# EAGLE design mwscoretransponder2013 (EAGLE 6.1)
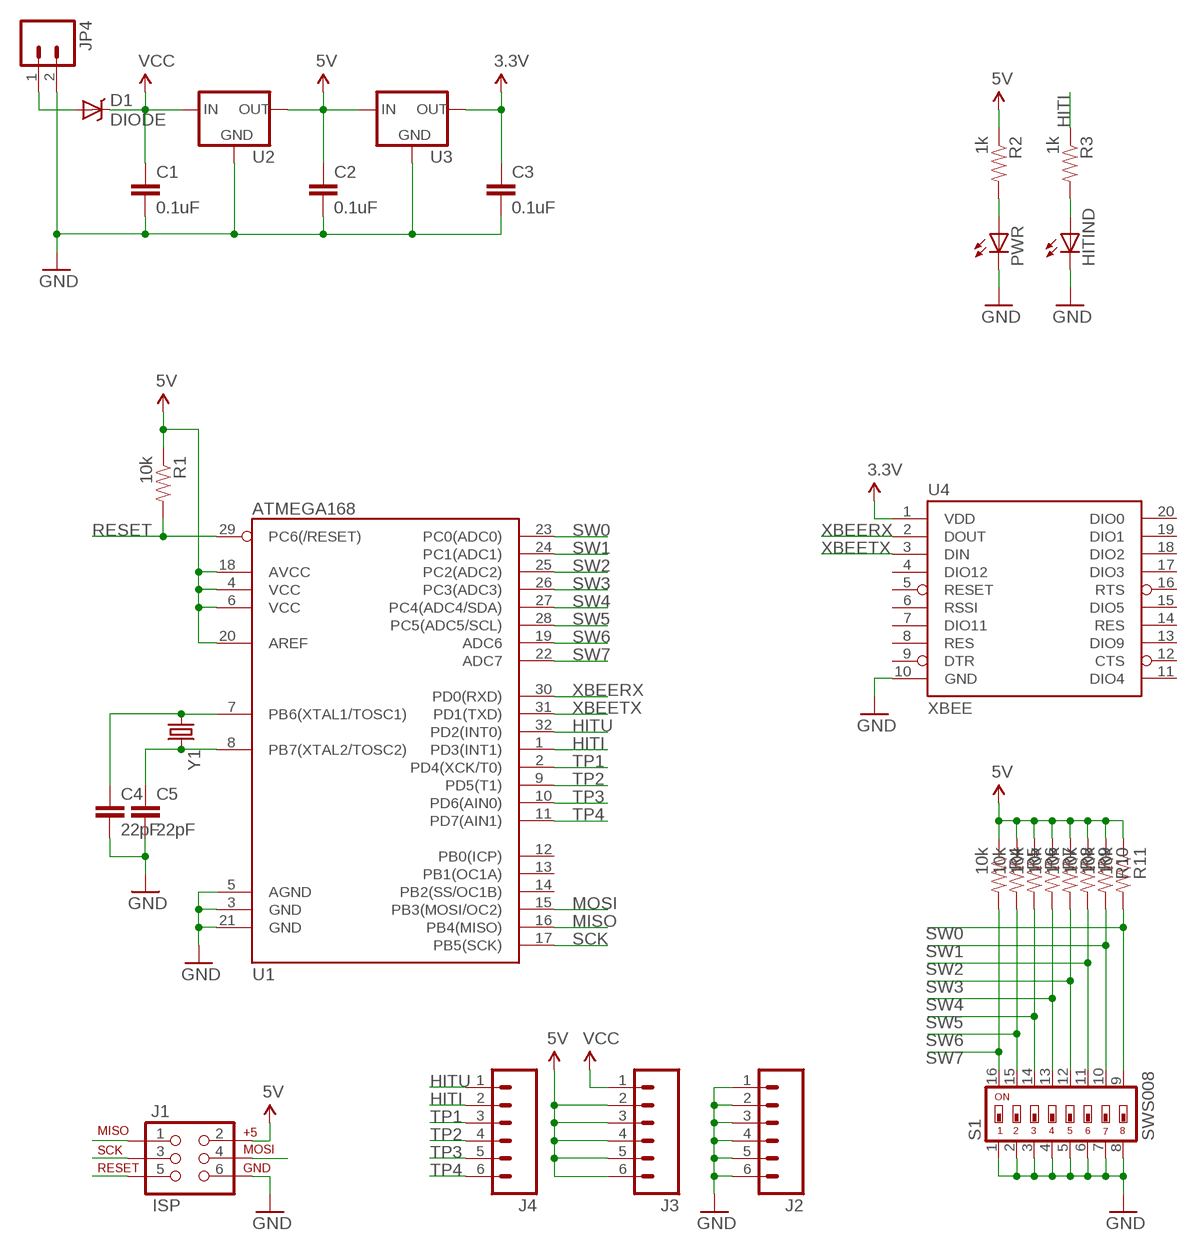
[diagram p0: schematic, sheet 1]

## Parts
C1  0.1uF  CAP0603-CAP  [0603-CAP]
C2  0.1uF  CAP0603-CAP  [0603-CAP]
C3  0.1uF  CAP0603-CAP  [0603-CAP]
C4  22pF  CAP0603-CAP  [0603-CAP]
C5  22pF  CAP0603-CAP  [0603-CAP]
D1  DIODE  DIODE-SCHOTTKY_  [SMA-DIODE]
HITIND  LED0603  [LED-0603]
J1  ISP  AVR_SPI_PRG_6PTH  [2X3]
J2  M06SIP  [1X06]
J3  M06SIP  [1X06]
J4  M06SIP  [1X06]
JP4  M023.5MM_LOCK  [SCREWTERMINAL-3.5MM-2_LOCK]
PWR  LED0603  [LED-0603]
R1  10k  RESISTOR0603-RES  [0603-RES]
R2  1k  RESISTOR0603-RES  [0603-RES]
R3  1k  RESISTOR0603-RES  [0603-RES]
R4  10k  RESISTOR0603-RES  [0603-RES]
R5  10k  RESISTOR0603-RES  [0603-RES]
R6  10k  RESISTOR0603-RES  [0603-RES]
R7  10k  RESISTOR0603-RES  [0603-RES]
R8  10k  RESISTOR0603-RES  [0603-RES]
R9  10k  RESISTOR0603-RES  [0603-RES]
R10  10k  RESISTOR0603-RES  [0603-RES]
R11  10k  RESISTOR0603-RES  [0603-RES]
S1  SWS008  [SMS-008]
U1  ATMEGA168  [TQFP32-08]
U2  V_REG_MIC2920  [SOT223]
U3  V_REG_MIC2920  [SOT223]
U4  XBEE  XBEE-1B3  [XBEE-SMD]
Y1  CRYSTAL5X3  [CRYSTAL-SMD-5X3]

## Nets
3.3V: C3.1 U3.3(OUT) U4.1(VDD)
5V: C2.1 J1.2 J3.2 J3.3 J3.4 J3.5 J3.6 R1.1 R2.1 R4.1 R5.1 R6.1 R7.1 R8.1 R9.1 R10.1 R11.1 U1.4(VCC) U1.6(VCC) U1.18(AVCC) U1.20(AREF) U2.3(OUT) U3.1(IN)
GND: C1.2 C2.2 C3.2 C4.2 C5.2 HITIND.C J1.6 J2.1 J2.2 J2.3 J2.4 J2.5 J2.6 JP4.2 PWR.C S1.1 S1.2 S1.3 S1.4 S1.5 S1.6 S1.7 S1.8 U1.3(GND) U1.5(AGND) U1.21(GND) U2.2(GND) U3.2(GND) U4.10(GND)
HITI: J4.2 R3.1 U1.1(PD3(INT1))
HITU: J4.1 U1.32(PD2(INT0))
MISO: J1.1 U1.16(PB4(MISO))
MOSI: J1.4 U1.15(PB3(MOSI/OC2))
N$1: PWR.A R2.2
N$2: HITIND.A R3.2
N$3: C4.1 U1.7(PB6(XTAL1/TOSC1)) Y1.1
N$4: D1.A JP4.1
N$6: C5.1 U1.8(PB7(XTAL2/TOSC2)) Y1.3
RESET: J1.5 R1.2 U1.29(PC6(/RESET))
SCK: J1.3 U1.17(PB5(SCK))
SW0: R11.2 S1.9 U1.23(PC0(ADC0))
SW1: R10.2 S1.10 U1.24(PC1(ADC1))
SW2: R9.2 S1.11 U1.25(PC2(ADC2))
SW3: R8.2 S1.12 U1.26(PC3(ADC3))
SW4: R7.2 S1.13 U1.27(PC4(ADC4/SDA))
SW5: R6.2 S1.14 U1.28(PC5(ADC5/SCL))
SW6: R5.2 S1.15 U1.19(ADC6)
SW7: R4.2 S1.16 U1.22(ADC7)
TP1: J4.3 U1.2(PD4(XCK/T0))
TP2: J4.4 U1.9(PD5(T1))
TP3: J4.5 U1.10(PD6(AIN0))
TP4: J4.6 U1.11(PD7(AIN1))
VCC: C1.1 D1.C J3.1 U2.1(IN)
XBEERX: U1.30(PD0(RXD)) U4.2(DOUT)
XBEETX: U1.31(PD1(TXD)) U4.3(DIN)
Unconnected: U1.12(PB0(ICP)) U1.13(PB1(OC1A)) U1.14(PB2(SS/OC1B)) U4.4(DIO12) U4.5(RESET) U4.6(RSSI) U4.7(DIO11) U4.8(RES) U4.9(DTR) U4.11(DIO4) U4.12(CTS) U4.13(DIO9) U4.14(RES) U4.15(DIO5) U4.16(RTS) U4.17(DIO3) U4.18(DIO2) U4.19(DIO1) U4.20(DIO0)

## Library data of the parts
C1-C5 = SparkFun:CAP: Capacitor Standard 0603 ceramic capacitor, and 0.1" leaded capacitor.
D1 = SparkFun:DIODE-SCHOTTKY
HITIND PWR = SparkFun:LED: LEDs Standard schematic elements and footprints for 5mm, 3mm, 1206, and 0603 sized LEDs. 5mm - Spark Fun Electronics SKU : COM-00529 (and others)
J1 = SparkFun:AVR_SPI_PRG_6: AVR ISP 6 Pin This is the reduced ISP connector for AVR programming. Common on Arduino. This footprint will take up less PCB space and can be used with a 10-pin to 6-pin adapter such as SKU: BOB-08508
J2-J4 = SparkFun:M06: Header 6 Standard 6-pin 0.1" header. Use with straight break away headers (SKU : PRT-00116), right angle break away headers (PRT-00553), swiss pins (PRT-00743), machine pins (PRT-00117), and female headers (PRT-00115). Molex polarized connector foot print use with SKU : PRT-08094 with associated crimp pins and housings. NOTES ON THE VARIANTS LOCK and LOCK_LONGPADS... This footprint was designed to help hold the alignment of a through-hole component (i.e. 6-pin header) while soldering it into place. You may notice that each hole has been shifted either up or down by 0.005 of an inch from it's more standard position (which is a perfectly straight line). This slight alteration caused the pins (the squares in the middle) to touch the edges of the holes. Because they are alternating, it causes a "brace" to hold the component in place. 0.005 has proven to be the perfect amount of "off-center" position when using our standard breakaway headers. Although looks a little odd when you look at the bare footprint, once you have a header in there, the alteration is very hard to notice. Also, if you push a header all the way into place, it is covered up entirely on the bottom side. This idea of altering the position of holes to aid alignment will be further integrated into the Sparkfun Library for other footprints. It can help hold any component with 3 or more connection pins.
JP4 = SparkFun:M02: Header 2 Standard 2-pin 0.1" header. Use with straight break away headers (SKU : PRT-00116), right angle break away headers (PRT-00553), swiss pins (PRT-00743), machine pins (PRT-00117), and female headers (PRT-00115). Molex polarized connector foot print use with SKU : PRT-08233 with associated crimp pins and housings.
R1-R11 = SparkFun:RESISTOR: Resistor Basic schematic elements and footprints for 0603, 1206, and PTH resistors.
S1 = smd-special:SWS008: SMD Dip Switch 8 pol.
U1 = SparkFun:ATMEGA168
U2 U3 = SparkFun:V_REG_MIC2920: MIC2920A (http://www.micrel.com/_PDF/mic2920.pdf) - 400mA output LDO Regulator
U4 = SparkFun:XBEE-1
Y1 = SparkFun:CRYSTAL: Crystals Various standard crystals. Proven footprints. Spark Fun Electronics SKU : COM-00534

## Board
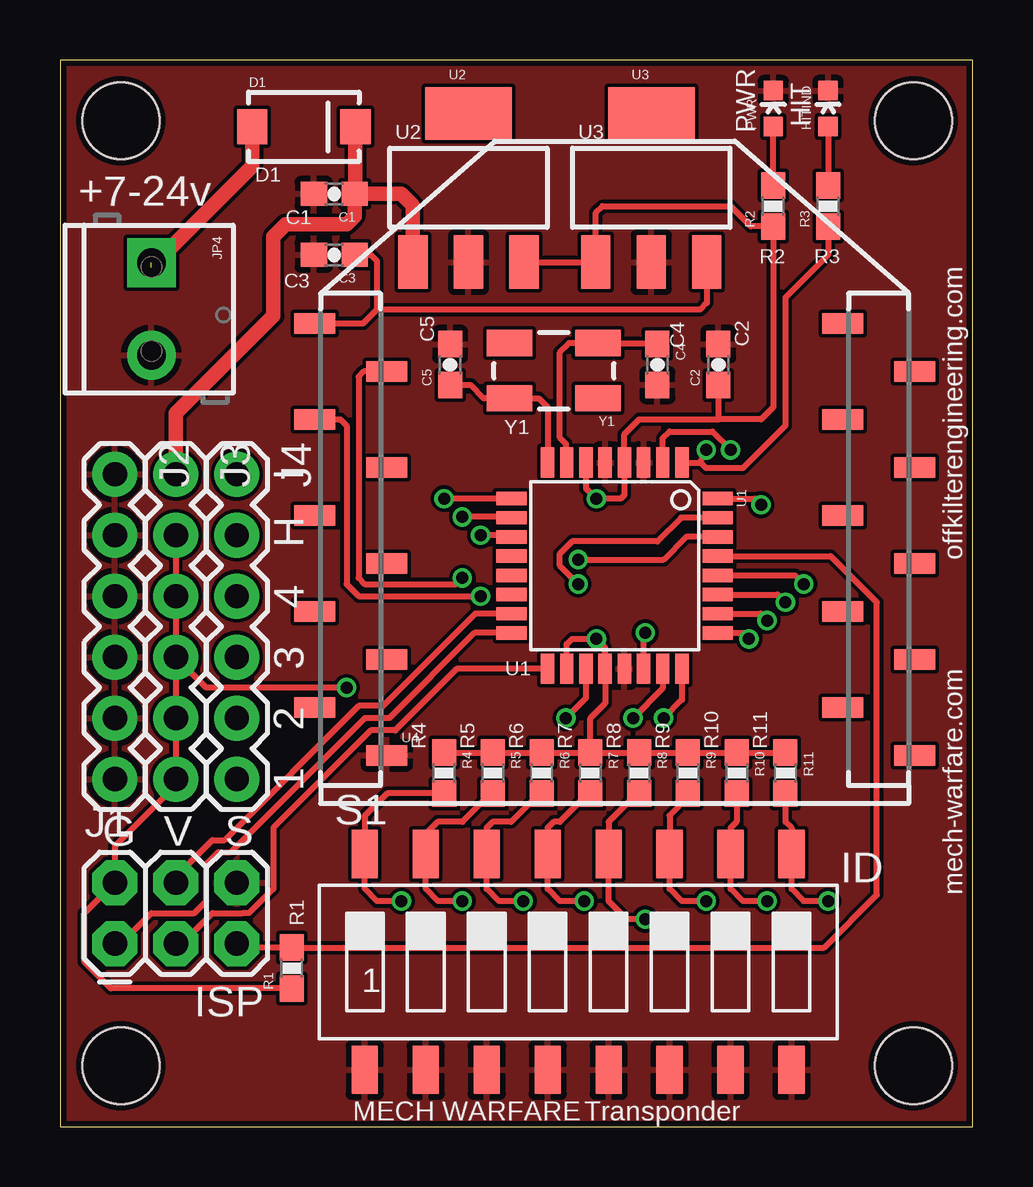
[diagram p1: board, top side]
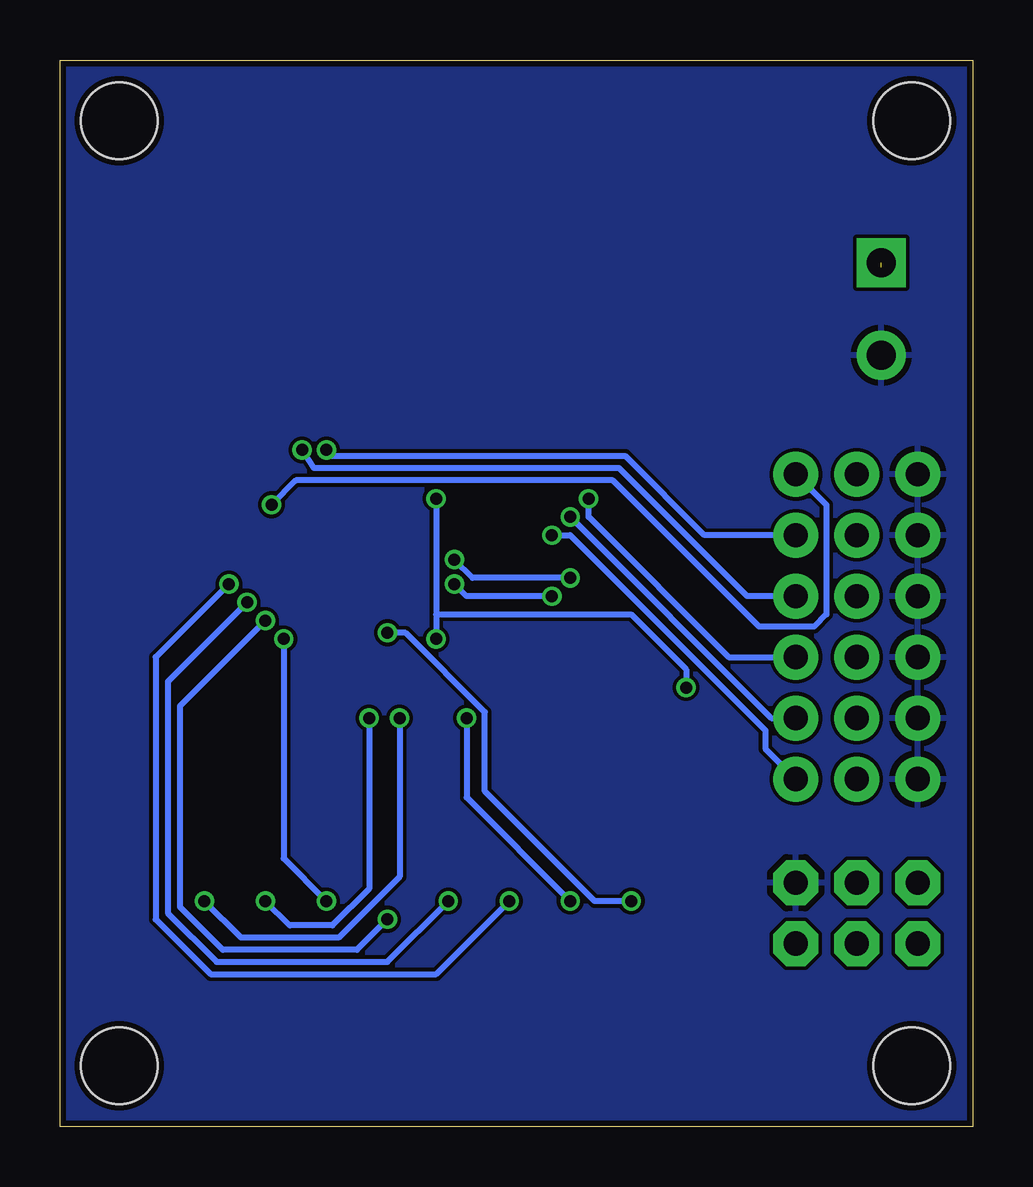
[diagram p2: board, bottom side, seen from below]

Size 38.02 x 44.44 mm. Coordinates in mm from the lower left corner, seen from the top.
Outline: 0,0 38.02,0 38.02,44.44 0,44.44 0,0
Copper layers (1*16): Top 0.035mm / dielectric 1.5mm / Bottom 0.035mm
Design rules: minimum track width 6mil, minimum drill 12mil, track to track 6mil, track to pad 6mil, pad to pad 6mil, via to via 6mil, smd to smd 0mil, copper to edge 10mil, drill to drill 10mil, minimum pad ring 10mil, minimum via ring 6mil, stop-mask expansion 2mil, vias tented up to drill 100mil, thermal gap 10mil
Holes 3.2 mm at 2.54,2.54 35.56,2.54 2.54,41.91 35.56,41.91

### Footprints (pad centres in the part's own frame; a part is rotated, then mirrored left to right if it is on the bottom)
0603-CAP = smd 1.1 x 1: 1 -0.85,0; 2 0.85,0
SMA-DIODE = smd 1.27 x 1.47: A -2.15,0; C 2.15,0
LED-0603 = smd 0.8 x 0.8: A 0,-0.75; C 0,0.75
2X3 = drill 1.016 pad 1.88 octagon: 1 0,0; 2 0,2.54; 3 2.54,0; 4 2.54,2.54; 5 5.08,0; 6 5.08,2.54
1X06 = drill 1.016 pad 1.88: 1 0,0; 2 2.54,0; 3 5.08,0; 4 7.62,0; 5 10.16,0; 6 12.7,0
SCREWTERMINAL-3.5MM-2_LOCK = drill 1.2 pad 2.032 square: 1 -0.178,0 | drill 1.2 pad 2.032: 2 3.678,0
0603-RES = smd 1.1 x 1: 1 -0.85,0; 2 0.85,0
SMS-008 = smd 1.092 x 2.007: 1 -8.89,-4.496; 2 -6.35,-4.496; 3 -3.81,-4.496; 4 -1.27,-4.496; 5 1.27,-4.496; 6 3.81,-4.496; 7 6.35,-4.496; 8 8.89,-4.496; 9 8.89,4.496; 10 6.35,4.496; 11 3.81,4.496; 12 1.27,4.496; 13 -1.27,4.496; 14 -3.81,4.496; 15 -6.35,4.496; 16 -8.89,4.496
TQFP32-08 = smd 1.27 x 0.559: 1 -4.293,2.8; 2 -4.293,2; 3 -4.293,1.2; 4 -4.293,0.4; 5 -4.293,-0.4; 6 -4.293,-1.2; 7 -4.293,-2; 8 -4.293,-2.8; 17 4.293,-2.8; 18 4.293,-2; 19 4.293,-1.2; 20 4.293,-0.4; 21 4.293,0.4; 22 4.293,1.2; 23 4.293,2; 24 4.293,2.8 | smd 0.559 x 1.27: 9 -2.8,-4.293; 10 -2,-4.293; 11 -1.2,-4.293; 12 -0.4,-4.293; 13 0.4,-4.293; 14 1.2,-4.293; 15 2,-4.293; 16 2.8,-4.293; 25 2.8,4.293; 26 2,4.293; 27 1.2,4.293; 28 0.4,4.293; 29 -0.4,4.293; 30 -1.2,4.293; 31 -2,4.293; 32 -2.8,4.293
SOT223 = smd 1.219 x 2.235: 1 -2.311,-3.099; 2 0,-3.099; 3 2.311,-3.099 | smd 3.6 x 2.2: 4 0,3.099
XBEE-SMD = smd 1.7 x 0.85: 1 -12.5,20; 2 -9.5,18; 3 -12.5,16; 4 -9.5,14; 5 -12.5,12; 6 -9.5,10; 7 -12.5,8; 8 -9.5,6; 9 -12.5,4; 10 -9.5,2; 11 12.5,2; 12 9.5,4; 13 12.5,6; 14 9.5,8; 15 12.5,10; 16 9.5,12; 17 12.5,14; 18 9.5,16; 19 12.5,18; 20 9.5,20
CRYSTAL-SMD-5X3 = smd 1.9 x 1.1: 1 -1.85,-1.15; 2 1.85,-1.15; 3 1.85,1.15; 4 -1.85,1.15

### Placement (x,y rotation side)
C1  11.43,38.86 180 top
C2  27.43,31.75 90 top
C3  11.43,36.32 180 top
C4  24.89,31.75 270 top
C5  16.26,31.75 90 top
D1  10.16,41.66 0 top
HITIND  32,42.42 0 top
J1  2.29,7.62 0 top
J2  2.29,27.18 270 top
J3  4.83,27.18 270 top
J4  7.37,27.18 270 top
JP4  3.81,35.81 270 top
PWR  29.72,42.42 0 top
R1  9.65,6.6 90 top
R2  29.72,38.35 90 top
R3  32,38.35 90 top
R4  16,14.73 270 top
R5  18.03,14.73 270 top
R6  20.07,14.73 270 top
R7  22.1,14.73 270 top
R8  24.13,14.73 270 top
R9  26.16,14.73 270 top
R10  28.19,14.73 270 top
R11  30.23,14.73 270 top
S1  21.59,6.86 0 top
U1  23.11,23.37 270 top
U2  17.02,39.12 0 top
U3  24.64,39.12 0 top
U4  23.11,13.46 0 top
Y1  20.57,31.5 180 top

### Tracks (layer width: path | path; a pad name or v marks a point on that pad's centre or on a via)
3.3V
  Top 0.254: U3.3 26.95,34.31 26.67,34.04 13.21,34.04 | 13.21,34.04 12.63,33.46 U4.1 | C3.1 12.95,36.32 13.21,36.07 13.21,34.04
5V  (via drill 0.5)
  Top 0.254: J3.2 J3.3 J3.4 | J3.4 J3.5 J3.6 4.83,14.22 2.29,11.68 J1.2 1.02,8.89 1.02,6.86 2.12,5.75 R1.1 | U1.6 21.91,26.6 v22.35,26.16 23.37,26.16 23.51,26.31 U1.4 23.51,28.85 24.13,29.46 27.43,29.46 | U1.18 21.11,20.1 21.34,20.32 v22.35,20.32 22.71,19.96 U1.20 22.71,17.63 22.1,17.02 R7.1 | C2.1 27.43,29.46 | U2.3 U3.1 22.33,38.08 22.61,38.35 27.94,38.35 28.79,37.5 R2.1 29.72,29.97 29.21,29.46 27.43,29.46 | R4.1 R5.1 R6.1 R7.1 | R7.1 R8.1 R9.1 R10.1 R11.1 | v11.94,18.29 6.1,18.29 J3.4
  Bottom 0.254: v22.35,26.16 22.35,21.34 | 22.35,21.34 v22.35,20.32 | 22.35,21.34 14.22,21.34 11.94,19.05 v11.94,18.29
GND
  Bottom 0.254: 3.05,14.48 J2.6
  pour Top: -0.76,45.21 -0.76,-1.02 38.86,-1.02 38.86,45.21
  pour Bottom: -0.76,44.96 38.35,44.96 38.61,44.7 38.61,-0.51 -0.51,-0.51 -0.76,-0.25
HITI  (via drill 0.5)
  Top 0.254: U1.1 26.64,27.66 26.67,27.69 | 26.67,27.69 v26.92,28.19 | R3.1 32,36.32 30.23,34.54 30.23,29.21 28.45,27.43 26.92,27.43 26.67,27.69
  Bottom 0.254: J4.2 11.18,24.64 14.48,27.94 26.67,27.94 v26.92,28.19
HITU  (via drill 0.5)
  Top 0.254: U1.32 28.95,26.17 v29.21,25.91
  Bottom 0.254: J4.1 6.1,25.91 6.1,21.34 6.6,20.83 8.89,20.83 14.99,26.92 28.19,26.92 v29.21,25.91
MISO
  Top 0.254: J1.1 2.54,7.62 3.81,8.89 5.59,8.89 6.1,9.4 6.1,10.92 6.6,11.43 7.11,11.43 12.7,17.02 13.72,17.02 17.27,20.57 U1.16
MOSI
  Top 0.254: J1.4 4.83,10.41 6.35,11.94 6.86,11.94 12.45,17.53 13.46,17.53 17.3,21.37 U1.15
N$1
  Top 0.254: R2.2 PWR.A
N$2
  Top 0.254: HITIND.A R3.2
N$3
  Top 0.254: U1.7 21.08,27.69 21.08,28.45 20.83,28.7 20.83,32.26 21.22,32.65 Y1.1 24.85,32.65 C4.1
N$4  (1 unrouted)
  Top 0.61: D1.A 8.01,40.01 3.81,35.81
N$6
  Top 0.254: U1.8 20.32,29.97 19.95,30.35 Y1.3 17.66,30.35 17.11,30.9 C5.1
RESET
  Top 0.254: 27.69,23.62 27.55,23.62 U1.29 32.11,23.77 34.04,21.84 34.04,9.65 31.84,7.45 R1.2 7.53,7.45 J1.5 7.45,7.53
SCK
  Top 0.254: J1.3 5.08,7.62 6.35,8.89 7.62,8.89 7.87,8.89 8.89,9.91 8.89,12.45 12.95,16.51 13.97,16.51 16.54,19.07 U1.17
SW0  (via drill 0.5)
  Top 0.254: U1.23 25.11,18.26 v23.88,17.02 | v32,9.4 30.99,9.4 30.48,9.91 S1.9 30.48,12.45 30.23,12.7 R11.2
  Bottom 0.254: v23.88,17.02 23.88,10.41 26.42,7.87 30.48,7.87 v32,9.4
SW1  (via drill 0.5)
  Top 0.254: U1.24 25.91,19.07 25.91,17.78 v25.15,17.02 | v29.46,9.4 28.45,9.4 27.94,9.91 S1.10 27.94,12.45 28.19,12.7 R10.2
  Bottom 0.254: v25.15,17.02 25.15,9.91 26.67,8.38 28.45,8.38 v29.46,9.4
SW2  (via drill 0.5)
  Top 0.254: U1.25 28.45,20.57 v28.7,20.32 | v26.92,9.4 25.91,9.4 25.4,9.91 S1.11 25.4,12.95 26.16,13.72 R9.2
  Bottom 0.254: v26.92,9.4 28.7,11.18 v28.7,20.32
SW3  (via drill 0.5)
  Top 0.254: U1.26 29.18,21.37 v29.46,21.08 | v24.38,8.64 23.62,8.64 22.86,9.4 S1.12 22.86,12.7 24.04,13.88 R8.2
  Bottom 0.254: v24.38,8.64 25.65,7.37 31.24,7.37 33.02,9.14 33.02,17.53 v29.46,21.08
SW4  (via drill 0.5)
  Top 0.254: U1.27 29.9,22.17 v30.23,21.84 | 20.32,11.43 S1.13 | v21.84,9.4 20.83,9.4 20.32,9.91 S1.13 | R7.2 22.01,13.88 20.83,12.7 20.57,12.7 20.32,12.45 S1.13
  Bottom 0.254: v30.23,21.84 33.53,18.54 33.53,8.89 31.5,6.86 24.38,6.86 v21.84,9.4
SW5  (via drill 0.5)
  Top 0.254: U1.28 30.63,22.97 v30.99,22.61 | R6.2 20.07,13.64 19.74,13.64 18.8,12.7 18.03,12.7 17.78,12.45 S1.14 17.78,9.91 18.29,9.4 v19.3,9.4
  Bottom 0.254: v30.99,22.61 34.04,19.56 34.04,8.64 31.75,6.35 22.35,6.35 v19.3,9.4
SW6  (via drill 0.5)
  Top 0.254: U1.19 21.91,17.85 v21.08,17.02 | v16.76,9.4 15.75,9.4 15.24,9.91 S1.15 15.24,12.19 15.75,12.7 16.76,12.7 17.95,13.88 R5.2
  Bottom 0.254: v21.08,17.02 21.08,13.72 v16.76,9.4
SW7  (via drill 0.5)
  Top 0.254: U1.22 24.31,20.5 v24.38,20.57 | v14.22,9.4 13.21,9.4 12.7,9.91 S1.16 12.7,12.95 13.63,13.88 R4.2
  Bottom 0.254: v14.22,9.4 15.75,9.4 20.32,13.97 20.32,17.27 23.62,20.57 v24.38,20.57
TP1  (via drill 0.5)
  Top 0.254: U1.2 25.11,28.67 25.4,28.96 27.18,28.96 v27.94,28.19
  Bottom 0.254: J4.3 9.4,22.1 14.73,27.43 27.43,27.43 v27.94,28.19
TP2  (via drill 0.5)
  Top 0.254: U1.9 v16,26.16
  Bottom 0.254: J4.4 10.16,19.56 16,25.4 v16,26.16
TP3  (via drill 0.5)
  Top 0.254: U1.10 18.79,25.4 v16.76,25.4
  Bottom 0.254: J4.5 8.38,17.02 v16.76,25.4
TP4  (via drill 0.5)
  Top 0.254: U1.11 18.75,24.64 v17.53,24.64
  Bottom 0.254: v17.53,24.64 16.76,24.64 8.64,16.51 8.64,15.75 J4.6
VCC
  Top 0.254: 12.31,38.89 C1.1
  Top 0.61: D1.C 12.31,38.89 | U2.1 14.71,38.38 14.22,38.86 C1.1 12.28,37.93 11.94,37.59 9.4,37.59 8.89,37.08 8.89,33.78 4.83,29.72 J3.1
XBEERX  (via drill 0.5)
  Top 0.254: U4.2 12.67,31.46 12.45,31.24 12.45,22.86 12.7,22.61 16.51,22.61 v16.76,22.86 | v21.59,23.62 25.15,23.62 26.09,24.57 U1.30
  Bottom 0.254: v16.76,22.86 20.83,22.86 v21.59,23.62
XBEETX  (via drill 0.5)
  Top 0.254: U4.3 11.69,29.46 11.94,29.21 11.94,22.61 12.45,22.1 v17.53,22.1 | v21.59,22.61 20.83,23.37 20.83,23.88 21.34,24.38 24.89,24.38 25.88,25.37 U1.31
  Bottom 0.254: v17.53,22.1 21.08,22.1 v21.59,22.61

### Text on the board
_tsilk: HIT | U2 | U3 | PWR | D1 | +7-24v | C1 | R2 | R3 | C3 | C5 | C4 | C2 | Y1 | I | H | offkilterengineering.com | 4 | 3 | U1 | 2 | R4 | R5 | R6 | R7 | R8 | R9 | R10 | R11 | 1 | G | V | S | ID | mech-warfare.com | R1 | ISP | MECH WARFARE | Transponder